# Altium schematic sheet cc2538.SchDoc: Edison Breakout
size Letter; Author: Ye-Sheng Kuo; Revision: 1; SheetTotal: 9
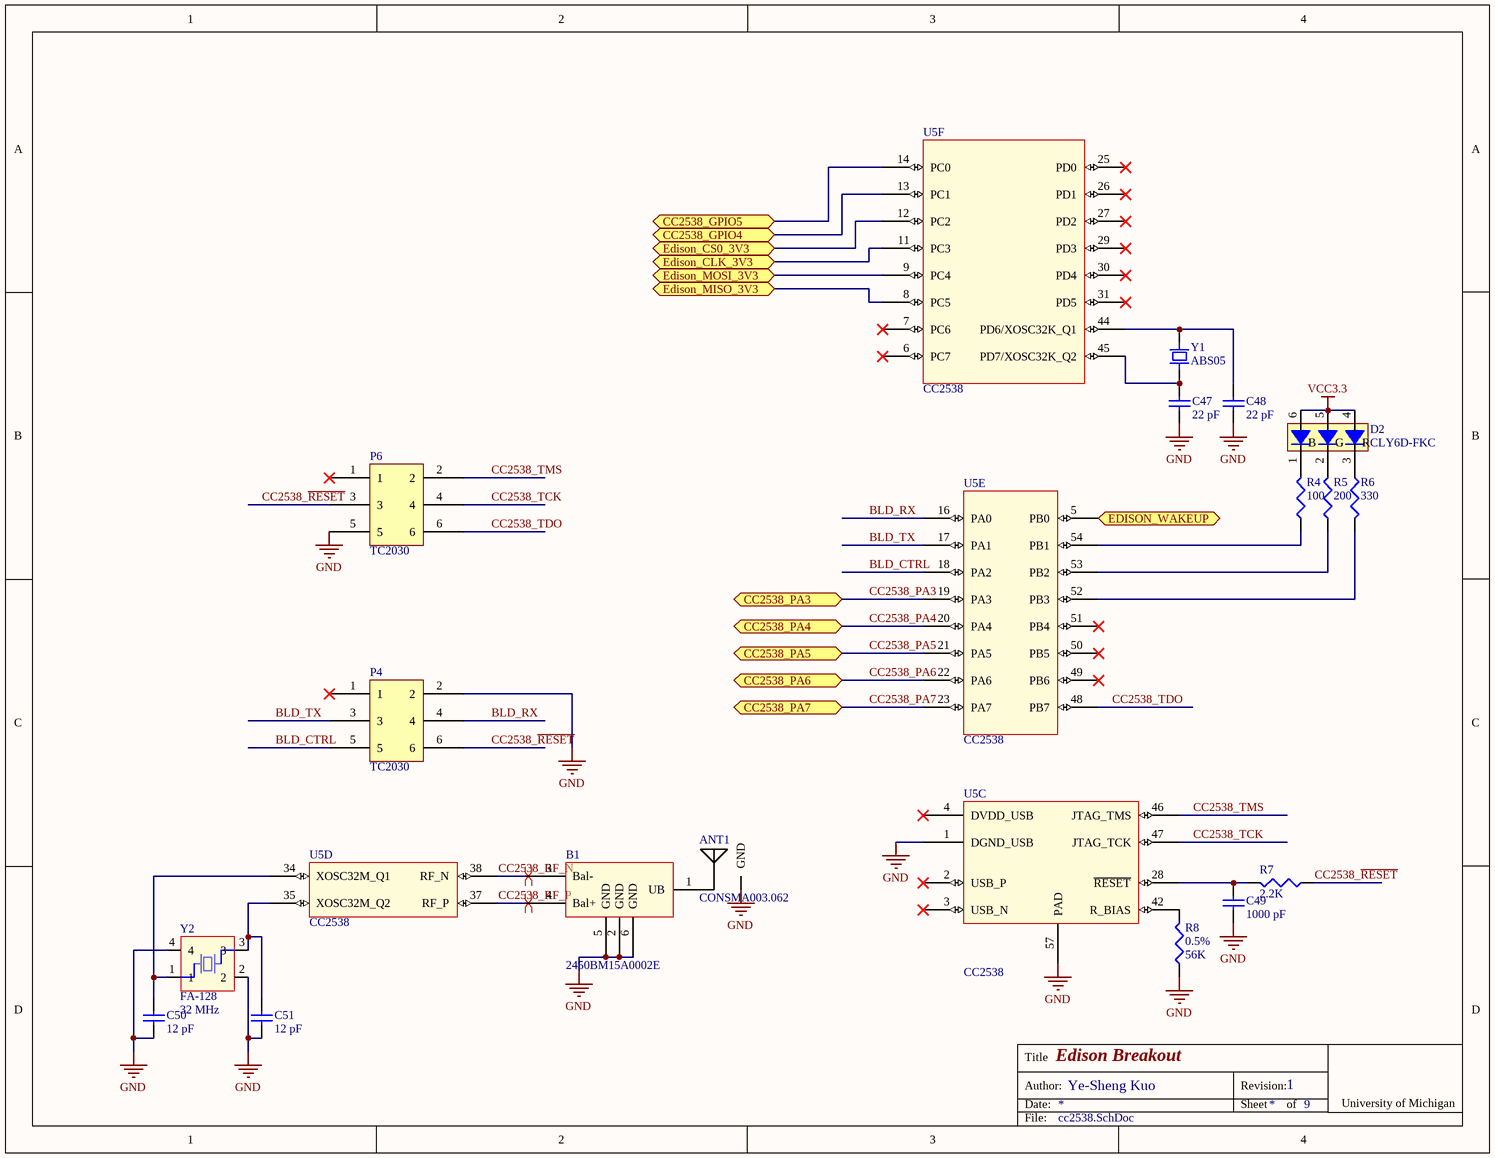
[diagram p0: cc2538.SchDoc]

## Parts
ANT1  CONSMA003.062  [CONSMA003.062]
B1  2450BM15A0002E  [2450BM15A0002]
C47  value 22 pF  [0402]  (hidden comment: Ceramic capacitor)
C48  value 22 pF  [0402]  (hidden comment: Ceramic capacitor)
C49  value 1000 pF  [0402]  (hidden comment: Ceramic capacitor)
C50  value 12 pF  [0402]  (hidden comment: Ceramic capacitor)
C51  value 12 pF  [0402]  (hidden comment: Ceramic capacitor)
D2  CLY6D-FKC  [PLCC6]
P4  TC2030  [TC2030-IDC-NLFP]
P6  TC2030  [TC2030-IDC-NLFP]
R4  value 100  [0402]  (hidden comment: Chip resistor)
R5  value 200  [0402]  (hidden comment: Chip resistor)
R6  value 330  [0402]  (hidden comment: Chip resistor)
R7  value 2.2K  [0402]  (hidden comment: Chip resistor)
R8  value 56K  tolerance: 0.5%  [0402]  (hidden comment: Chip resistor)
U5  CC2538  [QFN56]  (parts C,D,E,F of 6)
Y1  ABS05  [ABS05]
Y2  FA-128  frequency: 32 MHz  [FA-128]

## Ports
CC2538_GPIO4, CC2538_GPIO5, CC2538_PA3, CC2538_PA4, CC2538_PA5, CC2538_PA6, CC2538_PA7, Edison_CLK_3V3, Edison_CS0_3V3, Edison_MISO_3V3, Edison_MOSI_3V3, EDISON_WAKEUP

## Nets
GND: ANT1.1(GND) B1.2(GND) B1.5(GND) B1.6(GND) C47.2 C48.2 C49.2 C50.1 C51.1 P4.2 P6.5 R8.2 U5.1(DGND_USB) U5.57(PAD) Y2.2 Y2.4
VCC3.3: D2.4 D2.5 D2.6
BLD_CTRL: P4.5 U5.18(PA2)
BLD_RX: P4.4 U5.16(PA0)
BLD_TX: P4.3 U5.17(PA1)
CC2538_GPIO4: U5.13(PC1) ; port CC2538_GPIO4
CC2538_GPIO5: U5.14(PC0) ; port CC2538_GPIO5
CC2538_PA3: U5.19(PA3) ; port CC2538_PA3
CC2538_PA4: U5.20(PA4) ; port CC2538_PA4
CC2538_PA5: U5.21(PA5) ; port CC2538_PA5
CC2538_PA6: U5.22(PA6) ; port CC2538_PA6
CC2538_PA7: U5.23(PA7) ; port CC2538_PA7
CC2538_~{RESET}: P4.6 P6.3 R7.2
CC2538_RF_N: B1.3(Bal-) U5.38(RF_N)
CC2538_RF_P: B1.4(Bal+) U5.37(RF_P)
CC2538_TCK: P6.4 U5.47(JTAG_TCK)
CC2538_TDO: P6.6 U5.48(PB7)
CC2538_TMS: P6.2 U5.46(JTAG_TMS)
Edison_CLK_3V3: U5.11(PC3) ; port Edison_CLK_3V3
Edison_CS0_3V3: U5.12(PC2) ; port Edison_CS0_3V3
Edison_MISO_3V3: U5.8(PC5) ; port Edison_MISO_3V3
Edison_MOSI_3V3: U5.9(PC4) ; port Edison_MOSI_3V3
EDISON_WAKEUP: U5.5(PB0) ; port EDISON_WAKEUP
NetANT1_2: ANT1.2 B1.1(UB)
NetC47_1: C47.1 U5.45(PD7/XOSC32K_Q2) Y1.2
NetC48_1: C48.1 U5.44(PD6/XOSC32K_Q1) Y1.1
NetC49_1: C49.1 R7.1 U5.28(~{RESET})
NetC50_2: C50.2 U5.34(XOSC32M_Q1) Y2.1
NetC51_2: C51.2 U5.35(XOSC32M_Q2) Y2.3
NetD2_1: D2.1 R4.1
NetD2_2: D2.2 R5.1
NetD2_3: D2.3 R6.2
NetR4_2: R4.2 U5.54(PB1)
NetR5_2: R5.2 U5.53(PB2)
NetR6_1: R6.1 U5.52(PB3)
NetR8_1: R8.1 U5.42(R_BIAS)

Not connected (* = marked no-connect by the designer): P4 1*; P6 1*; U5 2(USB_P)* 3(USB_N)* 4(DVDD_USB)* 6(PC7)* 7(PC6)* 25(PD0)* 26(PD1)* 27(PD2)* 29(PD3)* 30(PD4)* 31(PD5)* 49(PB6)* 50(PB5)* 51(PB4)*

## Layout directives
differential pair: CC2538_RF_N, CC2538_RF_P

## Notes on the sheet
- Title
- Date:
- Author:
- Revision:
- Sheet
- of
- University of Michigan
- File:
- (in symbol D_CLY6D-FKC) B; G; R

## Library data of the parts
ANT1 = CONSMA003.062: CONN SMA JACK 50 OHM EDGE MNT; Supplier 1: Digi-Key; Supplier Part Number 1: CONSMA003.062-ND
B1 = 2450BM15A0002E: 2.45 GHz Balun for TI CC253X; Supplier 1: Digi-Key; Supplier Part Number 1: 712-1536-1-ND
C47 C48 = C_22p_0402_ceramic: Ceramic capacitor, 22 pF, 0402 package; Manufacture: Johanson; voltage rated: 50 V; tolerance: 2%; package: 0402; Supplier 1: Digi-Key; Supplier Part Number 1: 712-1274-1-ND
C49 = C_1000p_50V_0402_ceramic: Ceramic capacitor, 1000 pF, 0402 package; Manufacture: TDK; voltage rated: 50 V; tolerance: 10%; package: 0402; Supplier 1: Digi-Key; Supplier Part Number 1: 445-6846-1-ND
C50 C51 = C_12p_0402_ceramic: Ceramic capacitor, 12 pF, 0402 package; Manufacture: Johanson; voltage rated: 50 V; tolerance: 2%; package: 0402; Supplier 1: Digi-Key; Supplier Part Number 1: 712-1256-1-ND
D2 = D_CLY6D-FKC: CREE PLCC6 3 in 1 SMD LED; Supplier 1: Digi-Key; Supplier Part Number 1: CLY6D-FKC-CK1N1D1BB7D3D3CT-ND
P4 P6 = TC2030: TC2030-MCP-NL
R4 = R_100_0402: Chip resistor, 100, 0402 package; tolerance: 1%; power: 1/16 W; package: 0402; Supplier 1: Digi-Key; Supplier Part Number 1: 541-100LCT-ND
R5 = R_200_0402: Chip resistor, 200, 0402 package; tolerance: 1%; power: 1/16 W; package: 0402; Supplier 1: Digi-Key; Supplier Part Number 1: 541-200LCT-ND
R6 = R_330_0402: Chip resistor, 330, 0402 package; tolerance: 1%; power: 1/16 W; package: 0402; Supplier 1: Digi-Key; Supplier Part Number 1: 541-330LCT-ND
R7 = R_2.2K_0402: Chip resistor, 2.2K, 0402 package; tolerance: 1%; power: 1/16 W; package: 0402; Supplier 1: Digi-Key; Supplier Part Number 1: 541-2.20KLCT-ND
R8 = R_56K_0402: Chip resistor, 56K, 0402 package; power: 1/16 W; Temperature coefficient: 25 ppm/C; package: 0402; Supplier 1: Digi-Key; Supplier Part Number 1: P56KDECT-ND
U5 = CC2538: A Powerful System-On-Chip for 2.4-GHz IEEE 802.15.4, 6LoWPAN  and ZigBee Applications; Supplier 1: Digi-Key; Supplier Part Number 1: 296-35797-1-ND
Y1 = ABS05: 32768 Hz SMD Low profile crystal; Supplier 1: Digi-Key; Supplier Part Number 1: 535-11899-1-ND
Y2 = FA-128: MHz Range Crystal Unit; Load capatance: 10 pF; ESR: 60; stability: 20 ppm; Supplier 1: Digi-Key; Supplier Part Number 1: SER3800CT-ND